# EAGLE design pwm-4 (EAGLE 6.5.0)
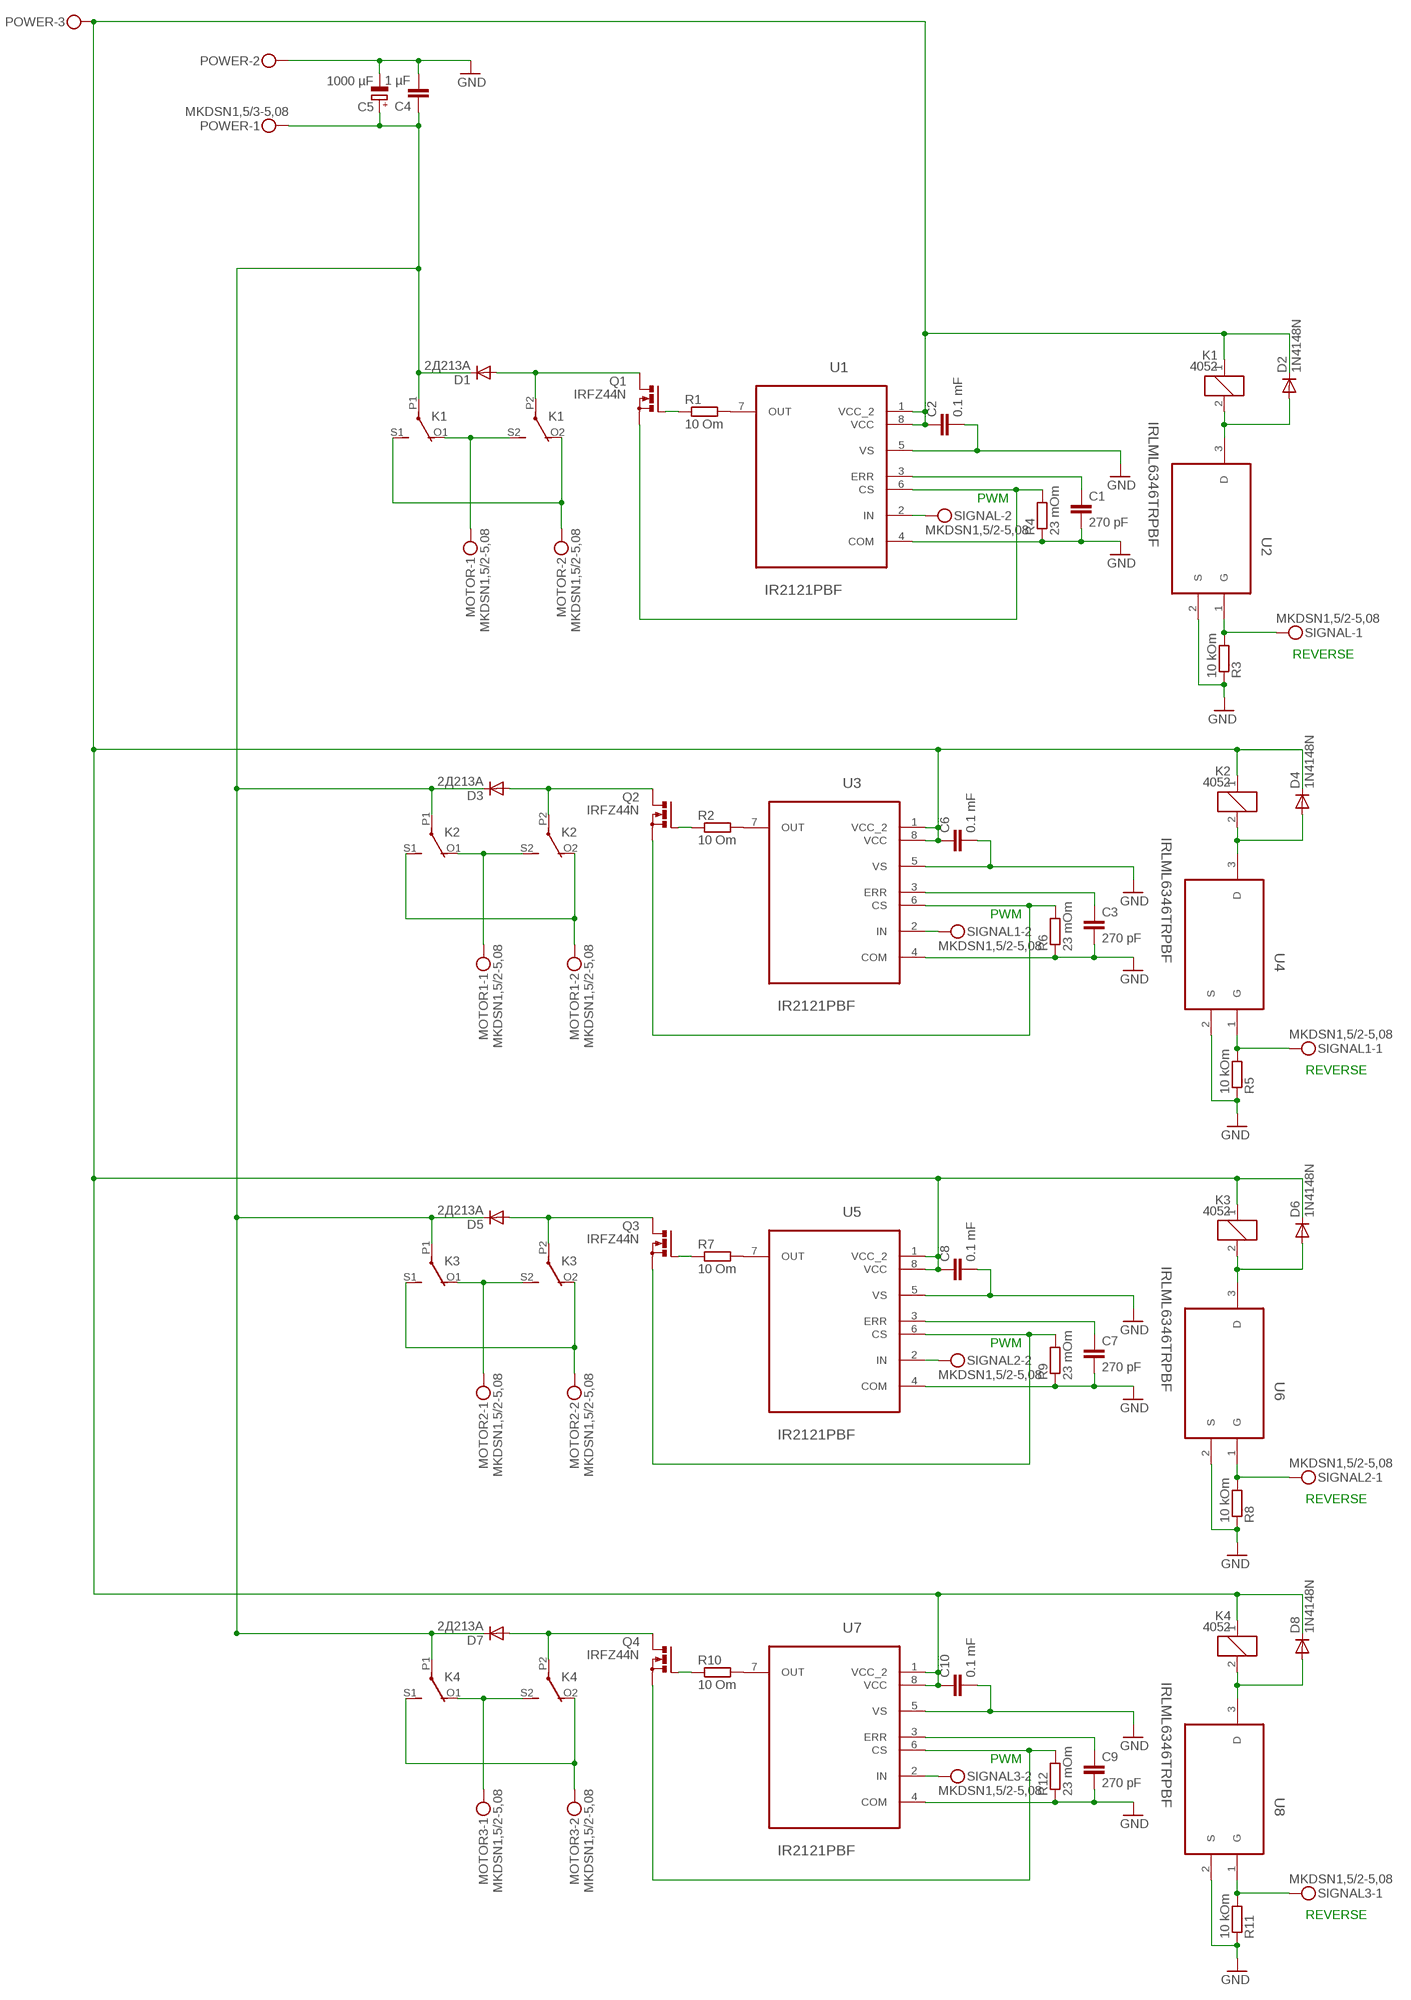
[diagram p0: schematic, sheet 1]

## Parts
C1  270 pF  C-EU025-025X050  [C025-025X050]
C2  0.1 mF  C-EU025-025X050  [C025-025X050]
C3  270 pF  C-EU025-025X050  [C025-025X050]
C4  1 µF  C2,5-3  [C2.5-3]
C5  1000 µF  CPOL-EUE7.5-18  [E7,5-18]
C6  0.1 mF  C-EU025-025X050  [C025-025X050]
C7  270 pF  C-EU025-025X050  [C025-025X050]
C8  0.1 mF  C-EU025-025X050  [C025-025X050]
C9  270 pF  C-EU025-025X050  [C025-025X050]
C10  0.1 mF  C-EU025-025X050  [C025-025X050]
D1  2Д213А  DIODE-C1702-05  [C1702-05]
D2  1N4148N  DIODE-D-2.5  [D-2.5]
D3  2Д213А  DIODE-C1702-05  [C1702-05]
D4  1N4148N  DIODE-D-2.5  [D-2.5]
D5  2Д213А  DIODE-C1702-05  [C1702-05]
D6  1N4148N  DIODE-D-2.5  [D-2.5]
D7  2Д213А  DIODE-C1702-05  [C1702-05]
D8  1N4148N  DIODE-D-2.5  [D-2.5]
K1  4052  [F4052]
K2  4052  [F4052]
K3  4052  [F4052]
K4  4052  [F4052]
MOTOR  MKDSN1,5/2-5,08  [MKDSN1,5/2-5,08]
MOTOR1  MKDSN1,5/2-5,08  [MKDSN1,5/2-5,08]
MOTOR2  MKDSN1,5/2-5,08  [MKDSN1,5/2-5,08]
MOTOR3  MKDSN1,5/2-5,08  [MKDSN1,5/2-5,08]
POWER  MKDSN1,5/3-5,08  [MKDSN1,5/3-5,08]
Q1  IRFZ44N  PMOSFET_NTO220BV  [TO220BV]
Q2  IRFZ44N  PMOSFET_NTO220BV  [TO220BV]
Q3  IRFZ44N  PMOSFET_NTO220BV  [TO220BV]
Q4  IRFZ44N  PMOSFET_NTO220BV  [TO220BV]
R1  10 Om  R-EU_0204/5  [0204/5]
R2  10 Om  R-EU_0204/5  [0204/5]
R3  10 kOm  R-EU_0204/5  [0204/5]
R4  23 mOm  R-EU_0204/5  [0204/5]
R5  10 kOm  R-EU_0204/5  [0204/5]
R6  23 mOm  R-EU_0204/5  [0204/5]
R7  10 Om  R-EU_0204/5  [0204/5]
R8  10 kOm  R-EU_0204/5  [0204/5]
R9  23 mOm  R-EU_0204/5  [0204/5]
R10  10 Om  R-EU_0204/5  [0204/5]
R11  10 kOm  R-EU_0204/5  [0204/5]
R12  23 mOm  R-EU_0204/5  [0204/5]
SIGNAL  MKDSN1,5/2-5,08  [MKDSN1,5/2-5,08]
SIGNAL1  MKDSN1,5/2-5,08  [MKDSN1,5/2-5,08]
SIGNAL2  MKDSN1,5/2-5,08  [MKDSN1,5/2-5,08]
SIGNAL3  MKDSN1,5/2-5,08  [MKDSN1,5/2-5,08]
U1  IR2121PBF  [DIP254P762X533-8]
U2  IRLML6346TRPBF  [SOT95P240X112-3N]
U3  IR2121PBF  [DIP254P762X533-8]
U4  IRLML6346TRPBF  [SOT95P240X112-3N]
U5  IR2121PBF  [DIP254P762X533-8]
U6  IRLML6346TRPBF  [SOT95P240X112-3N]
U7  IR2121PBF  [DIP254P762X533-8]
U8  IRLML6346TRPBF  [SOT95P240X112-3N]

## Nets
GND: C1.2 C2.2 C3.2 C4.2 C5.- C6.2 C7.2 C8.2 C9.2 C10.2 POWER.2 R3.1 R4.1 R5.1 R6.1 R8.1 R9.1 R11.1 R12.1 U1.4(COM) U1.5(VS) U2.2(S) U3.4(COM) U3.5(VS) U4.2(S) U5.4(COM) U5.5(VS) U6.2(S) U7.4(COM) U7.5(VS) U8.2(S)
N$1: SIGNAL.2 U1.2(IN)
N$2: R3.2 SIGNAL.1 U2.1(G)
N$3: K1.O1(2:O) K1.S2(3:S) MOTOR.1
N$5: K1.O2(3:O) K1.S1(2:S) MOTOR.2
N$6: D1.A K1.P2(3:P) Q1.D
N$7: C1.1 U1.3(ERR)
N$8: D2.A K1.2 U2.3(D)
N$10: C4.1 C5.+ D1.C D3.C D5.C D7.C K1.P1(2:P) K2.P1(2:P) K3.P1(2:P) K4.P1(2:P) POWER.1
N$11: Q1.G R1.1
N$13: Q1.S R4.2 U1.6(CS)
N$15: R1.2 U1.7(OUT)
N$20: C2.1 C6.1 C8.1 C10.1 D2.C D4.C D6.C D8.C K1.1 K2.1 K3.1 K4.1 POWER.3 U1.1(VCC_2) U1.8(VCC) U3.1(VCC_2) U3.8(VCC) U5.1(VCC_2) U5.8(VCC) U7.1(VCC_2) U7.8(VCC)
N$21: D4.A K2.2 U4.3(D)
N$22: K2.O2(3:O) K2.S1(2:S) MOTOR1.2
N$23: SIGNAL1.2 U3.2(IN)
N$24: C3.1 U3.3(ERR)
N$25: Q2.S R6.2 U3.6(CS)
N$26: R2.2 U3.7(OUT)
N$27: Q2.G R2.1
N$28: R5.2 SIGNAL1.1 U4.1(G)
N$30: K2.O1(2:O) K2.S2(3:S) MOTOR1.1
N$31: D3.A K2.P2(3:P) Q2.D
N$34: D6.A K3.2 U6.3(D)
N$35: K3.O2(3:O) K3.S1(2:S) MOTOR2.2
N$36: SIGNAL2.2 U5.2(IN)
N$37: C7.1 U5.3(ERR)
N$38: Q3.S R9.2 U5.6(CS)
N$39: R7.2 U5.7(OUT)
N$40: Q3.G R7.1
N$41: R8.2 SIGNAL2.1 U6.1(G)
N$42: K3.O1(2:O) K3.S2(3:S) MOTOR2.1
N$43: D5.A K3.P2(3:P) Q3.D
N$44: D8.A K4.2 U8.3(D)
N$45: K4.O2(3:O) K4.S1(2:S) MOTOR3.2
N$46: SIGNAL3.2 U7.2(IN)
N$47: C9.1 U7.3(ERR)
N$48: Q4.S R12.2 U7.6(CS)
N$49: R10.2 U7.7(OUT)
N$50: Q4.G R10.1
N$51: R11.2 SIGNAL3.1 U8.1(G)
N$52: K4.O1(2:O) K4.S2(3:S) MOTOR3.1
N$53: D7.A K4.P2(3:P) Q4.D

## Notes on the sheet
- PWM
- REVERSE
- PWM
- REVERSE
- PWM
- REVERSE
- PWM
- REVERSE

## Library data of the parts
C1-C3 C6-C10 = rcl:C-EU: CAPACITOR, European symbol
C4 = capacitor-wima:C: CAPACITOR naming: grid - package width
C5 = rcl:CPOL-EU: POLARIZED CAPACITOR, European symbol
D1-D8 = diode:DIODE-: DIODE
K1-K4 = relay:4052: RELAY 2 x switch, Finder; OC_FARNELL: unknown; OC_NEWARK: unknown
MOTOR MOTOR1-MOTOR3 SIGNAL SIGNAL1-SIGNAL3 = con-phoenix-508:MKDSN1,5/2-5,08: MKDSN 1,5/ 2-5,08 Printklemme Nennstrom: 13,5 A Nennspannung: 250 V Rastermaß: 5,08 mm Polzahl: 2 Anschlussart: Schraubanschluss Montage: Löten Anschlussrichtung Leiter/Platine: 0 ° Artikelnummer: 1729128 Source: http://eshop.phoenixcontact.com .. 1729128.pdf; MPN: MKDSN 1,5/2-5.08; OC_FARNELL: 1792903; OC_NEWARK: 30M2397
POWER = con-phoenix-508:MKDSN1,5/3-5,08: MKDSN 1,5/ 3-5,08 Printklemme Nennstrom: 13,5 A Nennspannung: 250 V Rastermaß: 5,08 mm Polzahl: 3 Anschlussart: Schraubanschluss Montage: Löten Anschlussrichtung Leiter/Platine: 0 ° Artikelnummer: 1729131 Source: http://eshop.phoenixcontact.com .. 1729131.pdf; MPN: SMKDSN1,5/3-5,08; OC_FARNELL: 1792904; OC_NEWARK: 70R0299
Q1-Q4 = transistor-power:PMOSFET_N: Power MOSFET N-Channel
R1-R12 = resistor:R-EU_: RESISTOR, European symbol
U1 U3 U5 U7 = International_Rectifier_By_element14_Batch_1:IR2121PBF: LOW SIDE DRIVER; MPN: IR2121PBF; OC_FARNELL: 9101705; OC_NEWARK: 63J7870; PACKAGE: PDIP; SUPPLIER: INTERNATIONAL RECTIFIER
U2 U4 U6 U8 = International_Rectifier_By_element14_Batch_1:IRLML6346TRPBF: Power MOSFET; MPN: IRLML6346TRPBF; OC_FARNELL: 1857300; OC_NEWARK: 25T5502; PACKAGE: SOT-23-3; SUPPLIER: INTERNATIONAL RECTIFIER

## Board
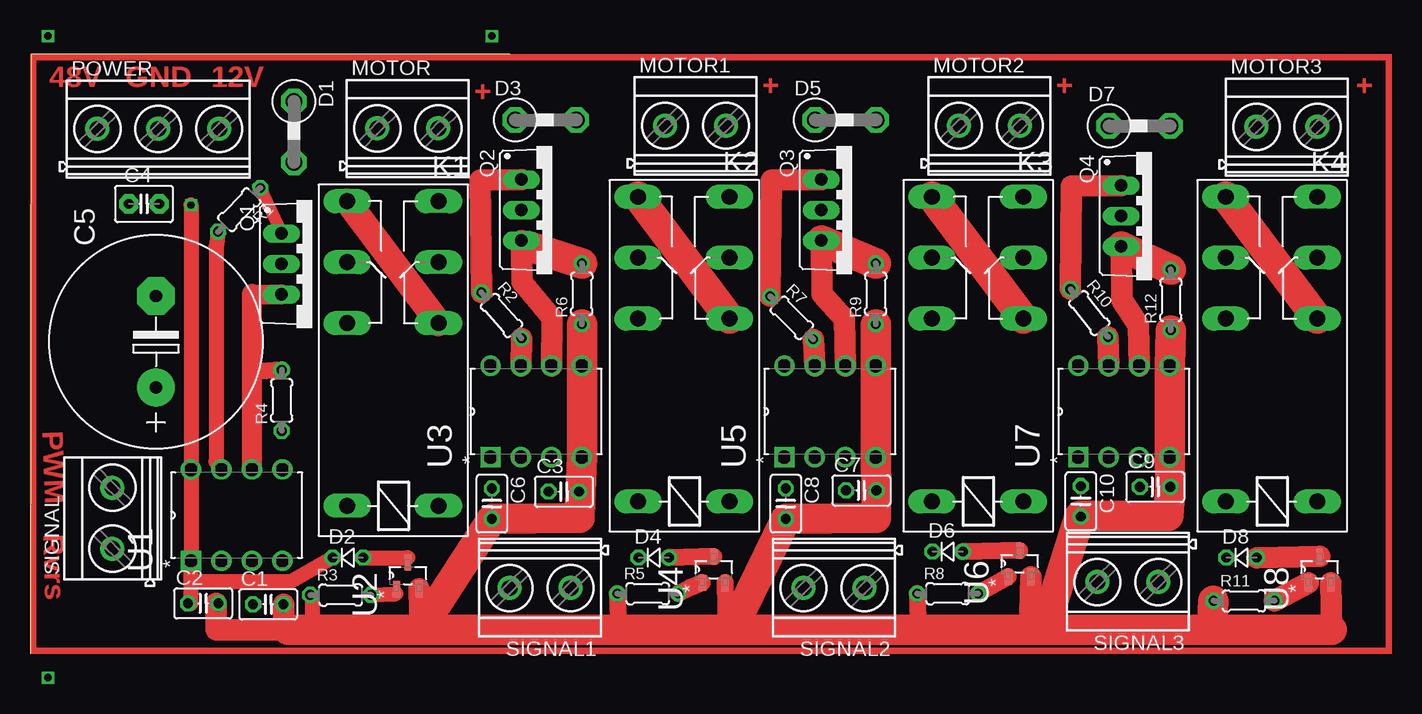
[diagram p1: board, top side]
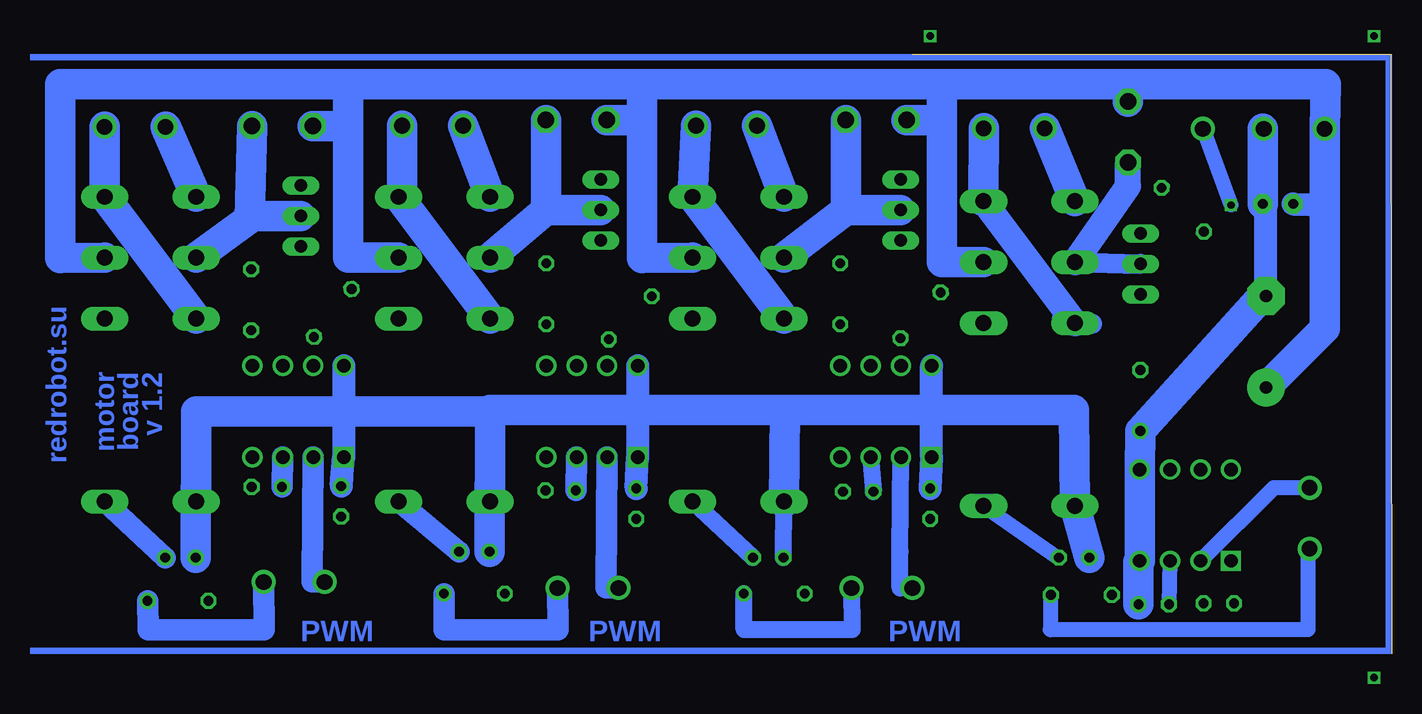
[diagram p2: board, bottom side, seen from below]

Size 40 x 50 mm. Coordinates in mm from the lower left corner, seen from the top.
Outline: 40,50 0.1,50 0,0
Copper layers (1*16): Top 0.035mm / dielectric 1.5mm / Bottom 0.035mm
Design rules "default": minimum track width 10mil, minimum drill 24mil, track to track 8mil, track to pad 8mil, pad to pad 8mil, via to via 8mil, smd to smd 8mil, copper to edge 40mil, drill to drill 8mil, minimum pad ring 10mil, minimum via ring 8mil, stop-mask expansion 4mil, vias tented up to drill 0mil, thermal gap 10mil

### Footprints (pad centres in the part's own frame; a part is rotated, then mirrored left to right if it is on the bottom)
C025-025X050 = drill 0.813 octagon: 1 -1.27,0; 2 1.27,0
C2.5-3 = drill 0.813 pad 1.6 octagon: 1 -1.27,0; 2 1.27,0
E7,5-18 = drill 1.016 pad 3.15: + -3.81,0 | drill 1.016 pad 3.15 octagon: - 3.81,0
C1702-05 = drill 1.397 octagon: A 2.54,0; C -2.54,0
D-2.5 = drill 0.813 octagon: A 1.27,0; C -1.27,0
F4052 = drill 1.321 long: 1 -3.81,3.81; 2 -3.81,-3.81; O1 11.43,-3.81; O2 11.43,3.81; P1 16.51,-3.81; P2 16.51,3.81; S1 21.59,-3.81; S2 21.59,3.81
MKDSN1,5/2-5,08 = drill 1.3 pad 2: 1 -2.561,0.025; 2 2.519,0.025
MKDSN1,5/3-5,08 = drill 1.3 pad 2: 1 -7.641,0.025; 2 -2.561,0.025; 3 2.519,0.025
TO220BV = drill 1.016 long: D 0,-2.54; G -2.54,-2.54; S 2.54,-2.54
0204/5 = drill 0.813 octagon: 1 -2.54,0; 2 2.54,0
DIP254P762X533-8 = drill 1.118 square: 1 -7.62,7.62 | drill 1.118: 2 -7.62,5.08; 3 -7.62,2.54; 4 -7.62,0; 5 0,0; 6 0,2.54; 7 0,5.08; 8 0,7.62
SOT95P240X112-3N = smd 1.321 x 0.559: 1 -1.092,0.94; 2 -1.092,-0.94; 3 1.092,0

### Placement (x,y rotation side)
C1  19.86,4.11 0 top
C2  14.44,4.19 0 top
C3  44.5,13.5 0 top  (outside the outline)
C4  9.5,37.5 0 top
C5  10.5,26 90 top
C6  38.5,12.5 270 top
C7  69.3,13.6 0 top  (outside the outline)
C8  63,12.5 270 top  (outside the outline)
C9  93.8,13.9 0 top  (outside the outline)
C10  87.6,12.7 270 top  (outside the outline)
D1  22,43.5 270 top
D2  26.5,8 0 top
D3  43,44.5 0 top
D4  52,8 0 top  (outside the outline)
D5  68,44.5 0 top  (outside the outline)
D6  76.5,8.5 0 top  (outside the outline)
D7  92.5,44 0 top  (outside the outline)
D8  101,8 0 top  (outside the outline)
K1  30.24,16.13 90 top
K2  54.5,16.5 90 top  (outside the outline)
K3  79,16.5 90 top  (outside the outline)
K4  103.5,16.5 90 top  (outside the outline)
MOTOR  31.51,43.78 0 top
MOTOR1  55.5,44 0 top  (outside the outline)
MOTOR2  80,44 0 top  (outside the outline)
MOTOR3  104.8,43.9 0 top  (outside the outline)
POWER  13.25,43.73 0 top
Q1  23.5,32.5 270 top
Q2  43.5,37 270 top
Q3  68.5,37 270 top  (outside the outline)
Q4  93.5,36.5 270 top  (outside the outline)
R1  17.44,37.01 226 top
R2  39.3,28.2 311.1 top
R3  25.9,4.89 0 top
R4  20.98,21.11 90 top
R5  51.5,5 0 top  (outside the outline)
R6  46,30 90 top  (outside the outline)
R7  63.5,28 315 top  (outside the outline)
R8  76.5,5 0 top  (outside the outline)
R9  70.5,30 90 top  (outside the outline)
R10  88.3,28.4 308.1 top  (outside the outline)
R11  101.2,4.4 0 top  (outside the outline)
R12  95.1,29.5 90 top  (outside the outline)
SIGNAL  6.89,11.31 90 top
SIGNAL1  42.5,5.5 180 top
SIGNAL2  67,5.5 180 top  (outside the outline)
SIGNAL3  91.5,6 180 top  (outside the outline)
U1  21.04,15.35 90 top
U2  31.5,6.5 90 top
U3  46,24 90 top
U4  57,7 90 top  (outside the outline)
U5  70.5,24 90 top  (outside the outline)
U6  82.5,7.5 90 top  (outside the outline)
U7  95,24 90 top  (outside the outline)
U8  107.5,7 90 top  (outside the outline)

### Tracks (layer width: path | path; a pad name or v marks a point on that pad's centre or on a via)
GND
  Top 1.27: C2.2 15.5,4.19 | 21.5,2 21.13,2 | R3.1 23.5,4.89 23.5,2 | C3.2 45.81,11.51 | 46,24.5 U3.5
  Top 1.422: U4.2 58,2 | R5.1 49,2 | R8.1 74,2
  Top 1.778: U2.2 32.5,2 | 15.5,4.19 15.5,2 21.13,2 C1.2 | U6.2 83.3,2 | R11.1 98.6,1.8 | U8.2 108.5,2 | 87.5,11.5 C10.2
  Top 2.54: 32.5,2 23.5,2 21.5,2 | 32.5,2 49,2 58,2 58.5,2 | 58.5,2 74,2 83.3,2 84.5,2 | 32.5,2 C6.2 45.8,11.3 45.81,11.51 U3.4 U3.5 | R6.1 46,24.5 | R12.1 U7.5 U7.4 C9.2 94.9,11.5 87.5,11.5 84.5,2 | 58.5,2 C8.2 70.5,11.3 C7.2 U5.4 U5.5 R9.1 | R11.1 98.5,2 | 98.5,2 84.5,2 | 108.5,2 98.5,2
  Bottom 0.406: 10.5,37.5 C4.2 | 10.77,43.75 POWER.2 | 10.82,29.81 C5.- | U1.4 21.13,7.64 | C1.2 21.13,4.89
  Bottom 1.93: C5.- 10.5,37.5
  Bottom 2.54: C4.2 10.77,43.75 | 10.82,29.81 R4.1 U1.5 U1.4 | 21.13,7.64 C1.2
N$1
  Bottom 1.27: SIGNAL.2 9.86,13.83 U1.2
N$2
  Top 0.406: 30.5,5 U2.1
  Top 1.27: R3.2 30.5,5
  Bottom 1.27: SIGNAL.1 7,8.75 7,2 28.44,2 | 28.5,2 28.44,2 | 28.44,2 R3.2
N$3
  Top 2.184: K1.S2 K1.O1
  Bottom 2.54: MOTOR.1 K1.S2
N$5
  Bottom 2.184: K1.S1 K1.O2
  Bottom 2.54: MOTOR.2 K1.S1
N$6
  Bottom 1.676: K1.P2 Q1.D
  Bottom 2.184: K1.P2 22,39 D1.A
N$7
  Bottom 1.27: U1.3 C1.1
N$8
  Top 0.406: U2.3 31.5,8
  Top 1.27: D2.A 31.5,8
  Bottom 1.27: K1.2 28,8.09 D2.A
N$10
  Bottom 0.406: 5.6,37.4 5.61,37.61
  Bottom 1.93: C4.1 5.6,37.4
  Bottom 2.54: K1.P1 37.5,32.64 37.5,44.5 | 37.5,47.5 22,47.5 | 22,47.5 D1.C | 5.61,37.61 POWER.1 5.5,47.5 22,47.5 | C5.+ 5.6,27.09 5.6,37.4 | 37.5,44.5 37.5,47.5 | 37.5,47.5 62.5,47.5 | 62.5,47.5 87,47.5 | 87,47.5 111,47.5 111,33 K4.P1 | K2.P1 62.5,33 62.5,44.5 | 62.5,44.5 62.5,47.5 | D3.C 37.5,44.5 | K3.P1 87,33.01 87,44 | D5.C 62.5,44.5 | 87,47.5 87,44 | 87,44 D7.C
N$11
  Top 1.016: R1.1 Q1.G
N$12  (via drill 0.6)
  other vias: 1.5,51.5
N$13
  Top 1.422: R4.2 18.5,23.5
  Top 1.676: U1.6 18.5,23.5 18.5,30 Q1.S
N$14  (via drill 0.6)
  other vias: 1.5,-2
N$15
  Top 1.27: R1.2 15.5,33.91 15.5,16 15.96,15.54 U1.7
N$16  (via drill 0.6)
  other vias: 38.5,51.5
N$18
  Bottom 1.676: 33,12.5 35,12.5
N$19
  Bottom 1.676: 25,27.5 27.5,27.5 27.5,28
N$20  (via drill 0.6)
  Top 0.406: 13.45,6 13.42,6.03
  Top 1.27: v13.42,37.41 U1.8 U1.1 13.42,6.03 13.42,4.19 C2.1 | D2.C 21.73,6 13.45,6
  Bottom 1.27: POWER.3 v13.42,37.41
  Bottom 1.422: D4.C K2.1
  Bottom 1.778: D6.C K3.1 | D8.C K4.1 | U7.1 87.5,14
  Bottom 1.93: C6.1 U3.1 38.38,20.3 U3.8 | U5.8 62.88,20.6 U5.1 C8.1 | U7.8 87.38,20.2 U7.1 C10.1
  Bottom 2.54: D2.C K1.1 26.5,20.3 38.38,20.3 50.6,20.3 | K4.1 99.7,19.1 | 50.6,20.3 50.7,12.6 K2.1 | 50.6,20.3 62.5,20.3 | 62.5,20.3 62.88,20.6 | K3.1 75.2,20.3 62.5,20.3 | D6.C 75.2,20.2 87.38,20.2 99.7,20.2 D8.C
N$21
  Top 1.422: U4.3 D4.A
  Bottom 1.422: K2.2 D4.A
N$22
  Bottom 2.54: K2.O2 K2.S1 MOTOR1.2
N$23
  Bottom 1.422: SIGNAL1.2 41,5.48 41,8.5 U3.2
N$24
  Bottom 1.422: U3.3 C3.1
N$25
  Top 1.778: Q2.S 40.97,33.5 | 40.97,33.5 41,31 43.5,28 U3.6 | 41.5,34 40.97,33.5
  Top 2.54: R6.2 41.5,34
N$26
  Top 1.778: U3.7 R2.2
N$27
  Top 1.778: Q2.G 37.5,39.5 R2.1
N$28
  Top 1.422: U4.1 56,5.91 55,5.5 R5.2
  Bottom 1.422: SIGNAL1.1 45,2 54,2 R5.2
N$30
  Top 2.54: K2.O1 K2.S2
  Bottom 2.54: MOTOR1.1 K2.S2
N$31
  Bottom 2.54: D3.A 45.5,37 | 45.5,37 K2.P2 | 45.5,37 Q2.D
N$34
  Top 1.422: U6.3 D6.A
  Bottom 1.778: K3.2 D6.A
N$35
  Bottom 1.778: K3.S1 82.5,38.5
  Bottom 2.54: MOTOR2.2 82.5,44.03 82.5,38.5 | K3.S1 K3.O2
N$36
  Bottom 1.778: U5.2 65.5,5.5 SIGNAL2.2
N$37
  Bottom 1.778: U5.3 C7.1
N$38
  Top 1.778: U5.6 67.9,27.9 66,30 Q3.S
  Top 2.54: Q3.S R9.2
N$39
  Top 1.778: U5.7 R7.2
N$40
  Top 1.778: R7.1 61.8,39.5 Q3.G
N$41
  Top 1.422: U6.1 R8.2
  Bottom 1.778: SIGNAL2.1 69.5,2 79,2 R8.2
N$42
  Top 2.54: K3.S2 K3.O1
  Bottom 2.54: MOTOR2.1 K3.S2
N$43
  Bottom 2.54: Q3.D 70.5,37 | 70.5,37 K3.P2 | D5.A 70.5,37
N$44
  Top 1.778: U8.3 D8.A
  Bottom 1.778: K4.2 D8.A
N$45
  Bottom 2.54: K4.O2 K4.S1 MOTOR3.2
N$46
  Bottom 1.778: SIGNAL3.2 90,6 U7.2
N$47
  Bottom 1.778: C9.1 U7.3
N$48
  Top 1.778: U7.6 92.4,27.4 91,29.5 Q4.S
  Top 2.54: Q4.S R12.2
N$49
  Top 1.778: U7.7 R10.2
N$50
  Top 1.778: Q4.G 86.8,39 R10.1
N$51
  Top 1.778: U8.1 R11.2
  Bottom 1.778: SIGNAL3.1 94,2 103.7,2 R11.2
N$52
  Top 2.54: K4.S2 K4.O1
  Bottom 2.54: MOTOR3.1 K4.S2
N$53
  Bottom 2.54: Q4.D 94.9,36.5 95.21,36.28 | 95.21,36.28 K4.P2 | D7.A 95.21,36.28
(copper drawn outside any net)
  shapes: Bottom area x4, Top area x8

### Text on the board
Top: 48V | GND | 12V | + | + | + | + | PWM | Rvrs
Bottom: redrobot.su | motor / board / v 1.2 | PWM | PWM | PWM